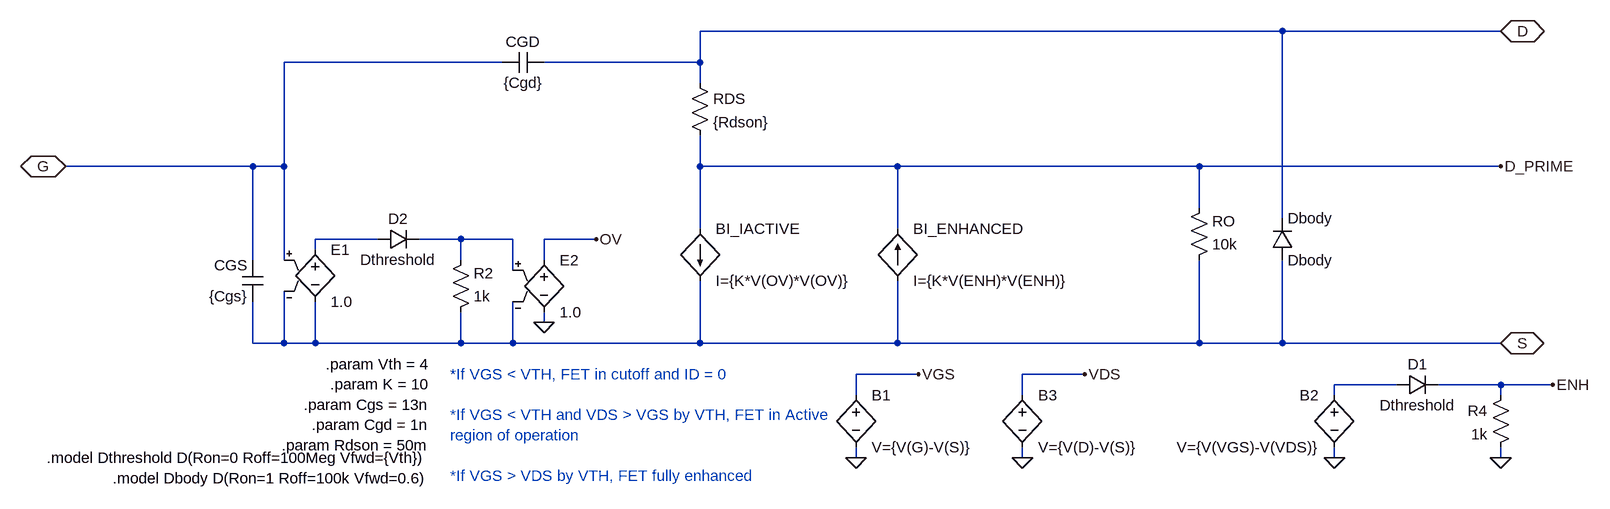
[diagram p0: schematic PWR_NMOS.asc]
PWR_NMOS.asc, the LTspice schematic file:
Version 4.1
SHEET 1 2916 1364
WIRE 1872 240 976 240
WIRE 2208 240 1872 240
WIRE 672 288 336 288
WIRE 976 288 976 240
WIRE 976 288 736 288
WIRE 976 320 976 288
WIRE 288 448 0 448
WIRE 336 448 336 288
WIRE 336 448 288 448
WIRE 976 448 976 400
WIRE 1280 448 976 448
WIRE 1744 448 1280 448
WIRE 2208 448 1744 448
WIRE 1744 512 1744 448
WIRE 1872 528 1872 240
WIRE 976 544 976 448
WIRE 1280 544 1280 448
WIRE 480 560 384 560
WIRE 608 560 544 560
WIRE 688 560 608 560
WIRE 816 560 736 560
WIRE 384 576 384 560
WIRE 288 592 288 448
WIRE 336 592 336 448
WIRE 608 592 608 560
WIRE 736 592 736 560
WIRE 688 608 688 560
WIRE 736 688 736 672
WIRE 288 720 288 656
WIRE 336 720 336 640
WIRE 336 720 288 720
WIRE 384 720 384 656
WIRE 384 720 336 720
WIRE 608 720 608 672
WIRE 608 720 384 720
WIRE 688 720 688 656
WIRE 688 720 608 720
WIRE 976 720 976 624
WIRE 976 720 688 720
WIRE 1280 720 1280 624
WIRE 1280 720 976 720
WIRE 1744 720 1744 592
WIRE 1744 720 1280 720
WIRE 1872 720 1872 592
WIRE 1872 720 1744 720
WIRE 2208 720 1872 720
WIRE 1312 768 1216 768
WIRE 1568 768 1472 768
WIRE 2048 784 1952 784
WIRE 2208 784 2112 784
WIRE 2288 784 2208 784
WIRE 1216 800 1216 768
WIRE 1472 800 1472 768
WIRE 1952 800 1952 784
WIRE 2208 800 2208 784
WIRE 1216 896 1216 880
WIRE 1472 896 1472 880
WIRE 1952 896 1952 880
WIRE 2208 896 2208 880
FLAG 2208 448 D_PRIME
FLAG 2208 720 S
IOPIN 2208 720 BiDir
FLAG 0 448 G
IOPIN 0 448 BiDir
FLAG 816 560 OV
FLAG 736 688 0
FLAG 2208 240 D
IOPIN 2208 240 BiDir
FLAG 2208 896 0
FLAG 1952 896 0
FLAG 2288 784 ENH
FLAG 1216 896 0
FLAG 1312 768 VGS
FLAG 1472 896 0
FLAG 1568 768 VDS
SYMBOL e 384 560 R0
SYMATTR InstName E1
SYMATTR Value 1.0
SYMBOL res 592 688 M180
WINDOW 0 36 76 Left 2
WINDOW 3 36 40 Left 2
SYMATTR InstName R2
SYMATTR Value 1k
SYMBOL diode 480 544 M90
WINDOW 0 0 32 VBottom 2
WINDOW 3 32 32 VTop 2
SYMATTR InstName D2
SYMATTR Value Dthreshold
SYMBOL cap 304 656 R180
WINDOW 0 24 56 Left 2
WINDOW 3 24 8 Left 2
SYMATTR InstName CGS
SYMATTR Value {Cgs}
SYMBOL cap 672 304 R270
WINDOW 0 32 32 VTop 2
WINDOW 3 0 32 VBottom 2
SYMATTR InstName CGD
SYMATTR Value {Cgd}
SYMBOL res 1728 608 M180
WINDOW 0 36 76 Left 2
WINDOW 3 36 40 Left 2
SYMATTR InstName RO
SYMATTR Value 10k
SYMBOL e 736 576 R0
SYMATTR InstName E2
SYMATTR Value 1.0
SYMBOL bi 976 544 R0
SYMATTR InstName BI_IACTIVE
SYMATTR Value I={K*V(OV)*V(OV)}
SYMBOL bv 1952 784 M0
SYMATTR InstName B2
SYMATTR Value V={V(VGS)-V(VDS)}
SYMBOL res 960 304 R0
SYMATTR InstName RDS
SYMATTR Value {Rdson}
SYMBOL diode 2048 800 R270
WINDOW 0 32 32 VTop 2
WINDOW 3 0 32 VBottom 2
SYMATTR InstName D1
SYMATTR Value Dthreshold
SYMBOL res 2224 784 M0
SYMATTR InstName R4
SYMATTR Value 1k
SYMBOL bi 1280 624 M180
WINDOW 0 24 80 Left 2
WINDOW 3 24 0 Left 2
SYMATTR InstName BI_ENHANCED
SYMATTR Value I={K*V(ENH)*V(ENH)}
SYMBOL bv 1216 784 R0
SYMATTR InstName B1
SYMATTR Value V={V(G)-V(S)}
SYMBOL bv 1472 784 R0
SYMATTR InstName B3
SYMATTR Value V={V(D)-V(S)}
SYMBOL diode 1856 592 M180
WINDOW 0 24 64 Left 2
WINDOW 3 24 0 Left 2
SYMATTR InstName Dbody
SYMATTR Value Dbody
TEXT 592 768 Left 2 ;*If VGS < VTH, FET in cutoff and ID = 0\n \n*If VGS < VTH and VDS > VGS by VTH, FET in Active\nregion of operation\n \n*If VGS > VDS by VTH, FET fully enhanced
TEXT 560 752 Right 2 !.param Vth = 4\n.param K = 10\n.param Cgs = 13n\n.param Cgd = 1n\n.param Rdson = 50m
TEXT 560 896 Right 2 !.model Dthreshold D(Ron=0 Roff=100Meg Vfwd={Vth})
TEXT 560 928 Right 2 !.model Dbody D(Ron=1 Roff=100k Vfwd=0.6)

The netlist it stands for:
* PWR_NMOS.asc
E1 N001 S G S 1.0
R2 S N002 1k
D2 N001 N002 Dthreshold
CGS S G {Cgs}
CGD G D {Cgd}
RO S D_PRIME 10k
E2 OV 0 N002 S 1.0
BI_IACTIVE D_PRIME S I={K*V(OV)*V(OV)}
B2 N003 0 V={V(VGS)-V(VDS)}
RDS D D_PRIME {Rdson}
D1 N003 ENH Dthreshold
R4 ENH 0 1k
BI_ENHANCED S D_PRIME I={K*V(ENH)*V(ENH)}
B1 VGS 0 V={V(G)-V(S)}
B3 VDS 0 V={V(D)-V(S)}
Dbody S D Dbody
.model D D
.lib standard.dio
* *If VGS < VTH, FET in cutoff and ID = 0
* *If VGS < VTH and VDS > VGS by VTH, FET in Active
* region of operation
* *If VGS > VDS by VTH, FET fully enhanced
.param Vth = 4
.param K = 10
.param Cgs = 13n
.param Cgd = 1n
.param Rdson = 50m
.model Dthreshold D(Ron=0 Roff=100Meg Vfwd={Vth})
.model Dbody D(Ron=1 Roff=100k Vfwd=0.6)
.backanno
.end